# EAGLE design I2C_Breakout_Block (EAGLE 6.6.0)

## Sheet 1 of 2
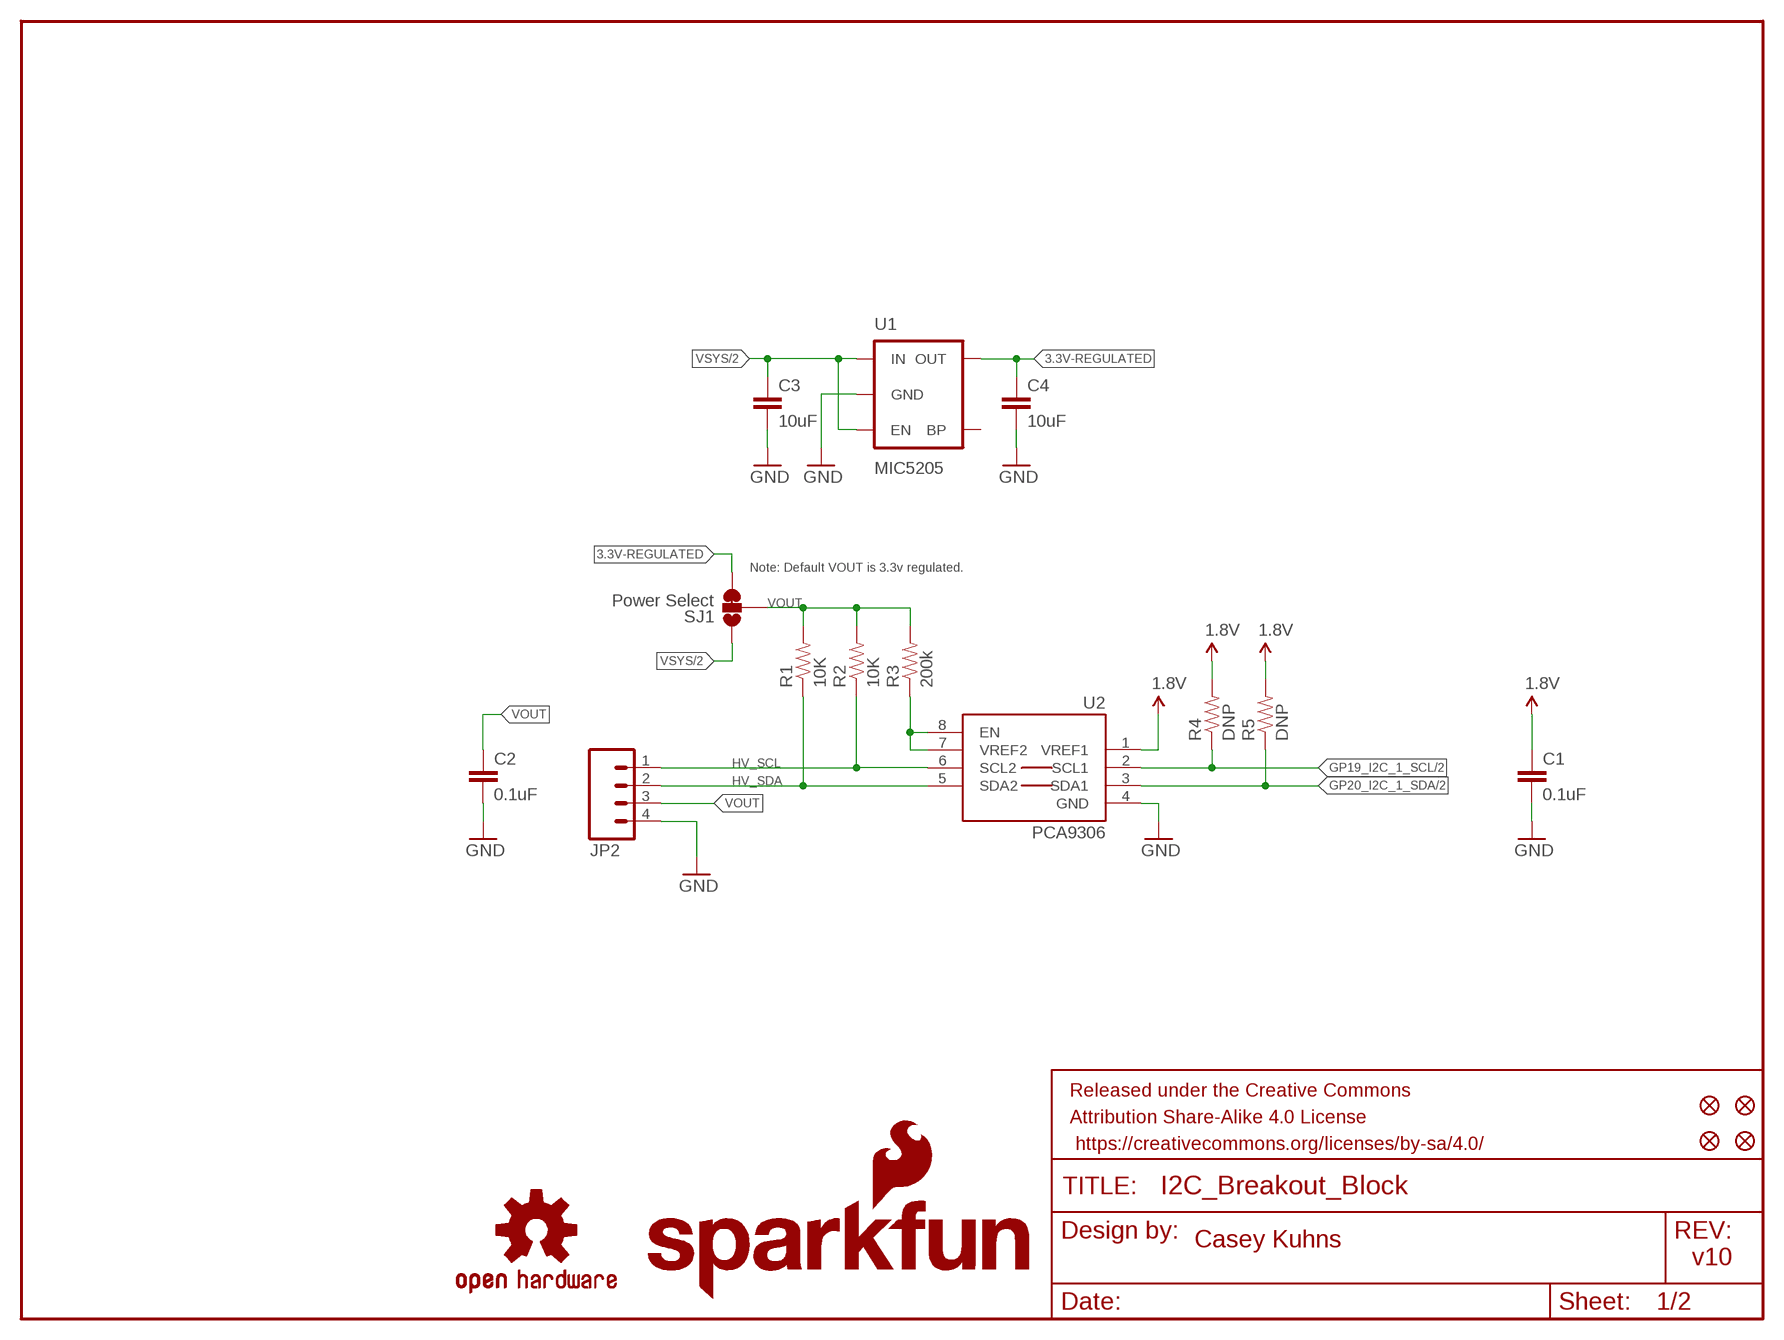
[diagram p0: schematic, sheet 1]

### Parts
C1  0.1uF  0.1UF-25V(+80/-20%)(0603)  [0603-CAP]
C2  0.1uF  0.1UF-25V(+80/-20%)(0603)  [0603-CAP]
C3  10uF  10UF-6.3V-20%(1206)  [1206]
C4  10uF  10UF-6.3V-20%(1206)  [1206]
FID1  FIDUCIAL1X2  [FIDUCIAL-1X2]
FID2  FIDUCIAL1X2  [FIDUCIAL-1X2]
FID3  FIDUCIAL1X2  [FIDUCIAL-1X2]
FID4  FIDUCIAL1X2  [FIDUCIAL-1X2]
FRAME1  FRAME-LETTER  [CREATIVE_COMMONS]
JP2  M04SMD_RA_FEMALE  [1X04_SMD_RA_FEMALE]
LOGO1  SFE_LOGO_NAME_FLAME.1_INCH  [SFE_LOGO_NAME_FLAME_.1]
LOGO2  OSHW-LOGOS  [OSHW-LOGO-S]
LOGO3  SFE_LOGO_NAME_FLAME.1_INCH  [SFE_LOGO_NAME_FLAME_.1]
LOGO4  OSHW-LOGOS  [OSHW-LOGO-S]
R1  10K  10KOHM1/10W1%(0603)0603  [0603-RES]
R2  10K  10KOHM1/10W1%(0603)0603  [0603-RES]
R3  200k  200KOHM1/10W1%(0603)200K  [0603-RES]
R4  DNP  2.2KOHM1/10W1%(0603)  [0603-RES]
R5  DNP  2.2KOHM1/10W1%(0603)  [0603-RES]
SJ1  Power Select  JUMPER-PAD-3-2OF3_NC_BY_TRACE  [PAD-JUMPER-3-2OF3_NC_BY_TRACE_YES_SILK_FULL_BOX]
U1  MIC5205  MIC52053.3V  [SOT23-5]
U2  PCA9306  PCA9306PCA9306DC-1:1  [PCA9306DC-1:1]

### Nets
1.8V: C1.1 R4.2 R5.2 U2.1(VREF1) ; also sheet 2
3.3V-REGULATED: C4.1 SJ1.3 U1.5(OUT)
GND: C1.2 C2.2 C3.2 C4.2 JP2.4 U1.2(GND) U2.4(GND) ; also sheet 2
GP19_I2C_1_SCL: R4.1 U2.2(SCL1) ; also sheet 2
GP20_I2C_1_SDA: R5.1 U2.3(SDA1) ; also sheet 2
HV_SCL: JP2.1 R2.1 U2.6(SCL2)
HV_SDA: JP2.2 R1.1 U2.5(SDA2)
N$1: R3.1 U2.7(VREF2) U2.8(EN)
VOUT: C2.1 JP2.3 R1.2 R2.2 R3.2 SJ1.2
VSYS: C3.1 SJ1.1 U1.1(IN) U1.3(EN) ; also sheet 2
Unconnected: U1.4(BP)

### Notes on the sheet
- Note: Default VOUT is 3.3v regulated.
- Casey Kuhns
- v10

## Sheet 2 of 2
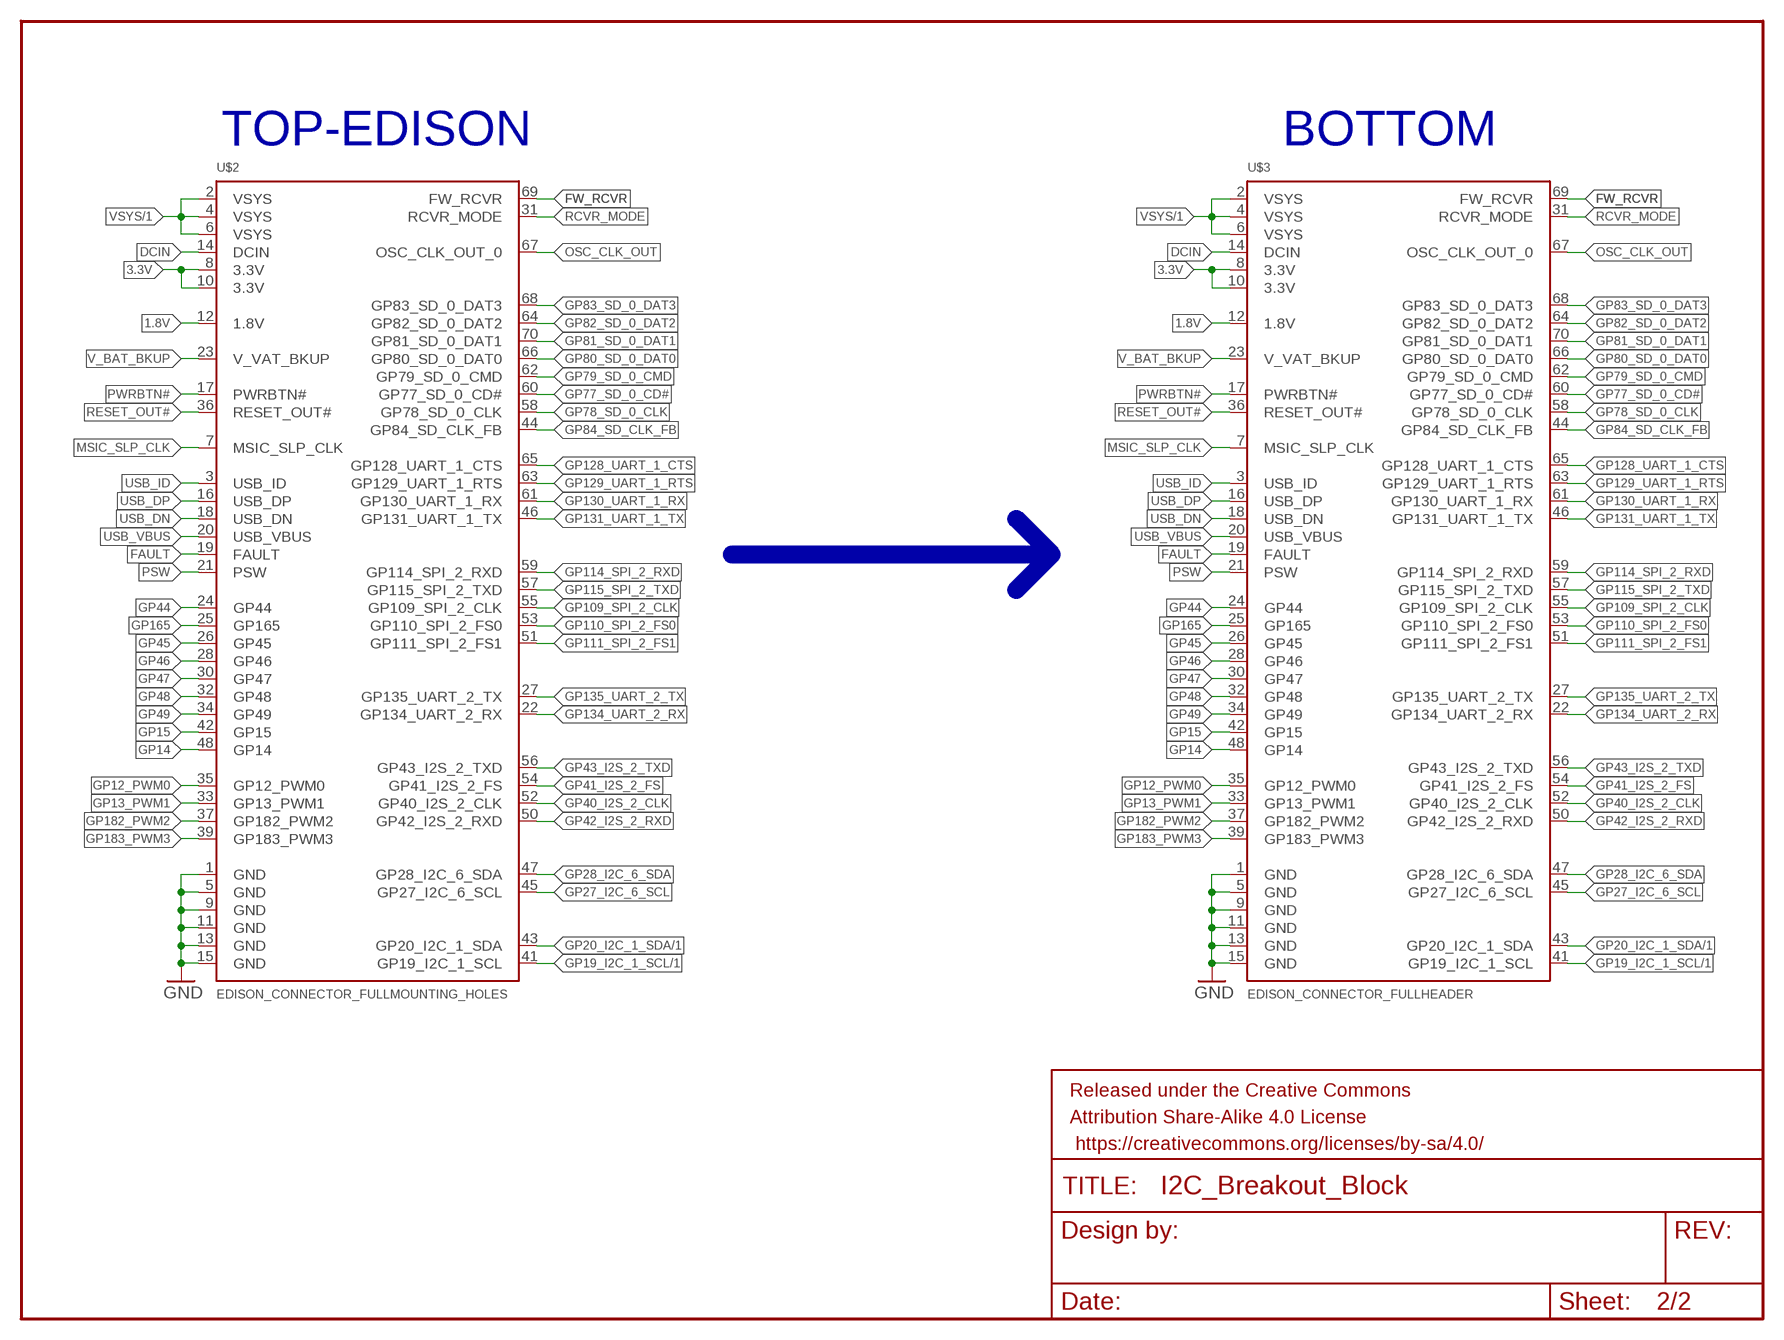
[diagram p1: schematic, sheet 2]

### Parts
FRAME2  FRAME-LETTER  [CREATIVE_COMMONS]
U$2  EDISON_CONNECTOR_FULLMOUNTING_HOLES  [EDISON_DAUGHTER]
U$3  EDISON_CONNECTOR_FULLHEADER  [DF40C-70DP-0.4(51)]

### Nets
1.8V: U$2.12(1.8V) U$3.12(1.8V) ; also sheet 1
3.3V: U$2.8(3.3V) U$2.10(3.3V) U$3.8(3.3V) U$3.10(3.3V)
DCIN: U$2.14(DCIN) U$3.14(DCIN)
FAULT: U$2.19(FAULT) U$3.19(FAULT)
FW_RCVR: U$2.69(FW_RCVR) U$3.69(FW_RCVR)
GND: U$2.1(GND) U$2.5(GND) U$2.9(GND) U$2.11(GND) U$2.13(GND) U$2.15(GND) U$3.1(GND) U$3.5(GND) U$3.9(GND) U$3.11(GND) U$3.13(GND) U$3.15(GND) ; also sheet 1
GP12_PWM0: U$2.35(GP12_PWM0) U$3.35(GP12_PWM0)
GP13_PWM1: U$2.33(GP13_PWM1) U$3.33(GP13_PWM1)
GP14: U$2.48(GP14) U$3.48(GP14)
GP15: U$2.42(GP15) U$3.42(GP15)
GP19_I2C_1_SCL: U$2.41(GP19_I2C_1_SCL) U$3.41(GP19_I2C_1_SCL) ; also sheet 1
GP20_I2C_1_SDA: U$2.43(GP20_I2C_1_SDA) U$3.43(GP20_I2C_1_SDA) ; also sheet 1
GP27_I2C_6_SCL: U$2.45(GP27_I2C_6_SCL) U$3.45(GP27_I2C_6_SCL)
GP28_I2C_6_SDA: U$2.47(GP28_I2C_6_SDA) U$3.47(GP28_I2C_6_SDA)
GP40_I2S_2_CLK: U$2.52(GP40_I2S_2_CLK) U$3.52(GP40_I2S_2_CLK)
GP41_I2S_2_FS: U$2.54(GP41_I2S_2_FS) U$3.54(GP41_I2S_2_FS)
GP42_I2S_2_RXD: U$2.50(GP42_I2S_2_RXD) U$3.50(GP42_I2S_2_RXD)
GP43_I2S_2_TXD: U$2.56(GP43_I2S_2_TXD) U$3.56(GP43_I2S_2_TXD)
GP44: U$2.24(GP44) U$3.24(GP44)
GP45: U$2.26(GP45) U$3.26(GP45)
GP46: U$2.28(GP46) U$3.28(GP46)
GP47: U$2.30(GP47) U$3.30(GP47)
GP48: U$2.32(GP48) U$3.32(GP48)
GP49: U$2.34(GP49) U$3.34(GP49)
GP77_SD_0_CD#: U$2.60(GP77_SD_0_CD#) U$3.60(GP77_SD_0_CD#)
GP78_SD_0_CLK: U$2.58(GP78_SD_0_CLK) U$3.58(GP78_SD_0_CLK)
GP79_SD_0_CMD: U$2.62(GP79_SD_0_CMD) U$3.62(GP79_SD_0_CMD)
GP80_SD_0_DAT0: U$2.66(GP80_SD_0_DAT0) U$3.66(GP80_SD_0_DAT0)
GP81_SD_0_DAT1: U$2.70(GP81_SD_0_DAT1) U$3.70(GP81_SD_0_DAT1)
GP82_SD_0_DAT2: U$2.64(GP82_SD_0_DAT2) U$3.64(GP82_SD_0_DAT2)
GP83_SD_0_DAT3: U$2.68(GP83_SD_0_DAT3) U$3.68(GP83_SD_0_DAT3)
GP84_SD_CLK_FB: U$2.44(GP84_SD_CLK_FB) U$3.44(GP84_SD_CLK_FB)
GP109_SPI_2_CLK: U$2.55(GP109_SPI_2_CLK) U$3.55(GP109_SPI_2_CLK)
GP110_SPI_2_FS0: U$2.53(GP110_SPI_2_FS0) U$3.53(GP110_SPI_2_FS0)
GP111_SPI_2_FS1: U$2.51(GP111_SPI_2_FS1) U$3.51(GP111_SPI_2_FS1)
GP114_SPI_2_RXD: U$2.59(GP114_SPI_2_RXD) U$3.59(GP114_SPI_2_RXD)
GP115_SPI_2_TXD: U$2.57(GP115_SPI_2_TXD) U$3.57(GP115_SPI_2_TXD)
GP128_UART_1_CTS: U$2.65(GP128_UART_1_CTS) U$3.65(GP128_UART_1_CTS)
GP129_UART_1_RTS: U$2.63(GP129_UART_1_RTS) U$3.63(GP129_UART_1_RTS)
GP130_UART_1_RX: U$2.61(GP130_UART_1_RX) U$3.61(GP130_UART_1_RX)
GP131_UART_1_TX: U$2.46(GP131_UART_1_TX) U$3.46(GP131_UART_1_TX)
GP134_UART_2_RX: U$2.22(GP134_UART_2_RX) U$3.22(GP134_UART_2_RX)
GP135_UART_2_TX: U$2.27(GP135_UART_2_TX) U$3.27(GP135_UART_2_TX)
GP165: U$2.25(GP165) U$3.25(GP165)
GP182_PWM2: U$2.37(GP182_PWM2) U$3.37(GP182_PWM2)
GP183_PWM3: U$2.39(GP183_PWM3) U$3.39(GP183_PWM3)
MSIC_SLP_CLK: U$2.7(MSIC_SLP_CLK) U$3.7(MSIC_SLP_CLK)
OSC_CLK_OUT: U$2.67(OSC_CLK_OUT_0) U$3.67(OSC_CLK_OUT_0)
PSW: U$2.21(PSW) U$3.21(PSW)
PWRBTN#: U$2.17(PWRBTN#) U$3.17(PWRBTN#)
RCVR_MODE: U$2.31(RCVR_MODE) U$3.31(RCVR_MODE)
RESET_OUT#: U$2.36(RESET_OUT#) U$3.36(RESET_OUT#)
USB_DN: U$2.18(USB_DN) U$3.18(USB_DN)
USB_DP: U$2.16(USB_DP) U$3.16(USB_DP)
USB_ID: U$2.3(USB_ID) U$3.3(USB_ID)
USB_VBUS: U$2.20(USB_VBUS) U$3.20(USB_VBUS)
V_BAT_BKUP: U$2.23(V_VAT_BKUP) U$3.23(V_VAT_BKUP)
VSYS: U$2.2(VSYS) U$2.4(VSYS) U$2.6(VSYS) U$3.2(VSYS) U$3.4(VSYS) U$3.6(VSYS) ; also sheet 1

### Buses
B$1

### Notes on the sheet
- TOP-EDISON | BOTTOM

## Library data of the parts
C1 C2 = SparkFun-Capacitors:0.1UF-25V(+80/-20%)(0603): CAP-00810 Ceramic Standard decoupling cap; PROD_ID: CAP-00810
C3 C4 = SparkFun-Capacitors:10UF-6.3V-20%(1206): CAP-10057 Ceramic; PROD_ID: CAP-10057
FID1-FID4 = SparkFun-Aesthetics:FIDUCIAL: Fiducial Alignment Points Various fiducial points for machine vision alignment.
FRAME1 FRAME2 = SparkFun-Aesthetics:FRAME-LETTER: Schematic Frame Standard 8.5x11 US Letter frame
JP2 = SparkFun-Connectors:M04: Header 4 Standard 4-pin 0.1" header. Use with straight break away headers (SKU : PRT-00116), right angle break away headers (PRT-00553), swiss pins (PRT-00743), machine pins (PRT-00117), and female headers (PRT-00115). Molex polarized connector foot print use with SKU : PRT-08231 with associated crimp pins and housings. 1MM SMD Version SKU: PRT-10208
LOGO1 LOGO3 = SparkFun-Aesthetics:SFE_LOGO_NAME_FLAME: SFE Logo, name and flame This is the SparkFun full logo. The logo on the schematic will always be the same size; the package variant is the height of the flame part of the logo. Default layer for the logo on the board is tSilk.
LOGO2 LOGO4 = SparkFun-Aesthetics:OSHW-LOGO: Open Source Hardware Logo This logo indicates the piece of hardware it is found on incorporates a OSHW license and/or adheres to the definition of open source hardware found here: http://freedomdefined.org/OSHW
R1 R2 = SparkFun-Resistors:10KOHM1/10W1%(0603): RES-00824; PROD_ID: RES-00824
R3 = SparkFun-Resistors:200KOHM1/10W1%(0603): RES-09385; PROD_ID: RES-09385
R4 R5 = SparkFun-Resistors:2.2KOHM1/10W1%(0603): RES-08272; PROD_ID: RES-08272; VALUE: 2.2k
SJ1 = SparkFun-Passives:JUMPER-PAD-3-2OF3_NC_BY_TRACE
U1 = SparkFun-PowerIC:MIC5205: MIC5205 150mA vreg 3.3V - VREG-00822 5V - VREG-00823; PROD_ID: VREG-00822
U2 = SparkFun-DigitalIC:PCA9306: Bidirectional I2C level shifter. NOT compatible with all available part number pinout schemes- DOUBLE CHECK!!!; PROD_ID: IC-10023
U$2 U$3 = Edison:EDISON_CONNECTOR_FULL

## Board
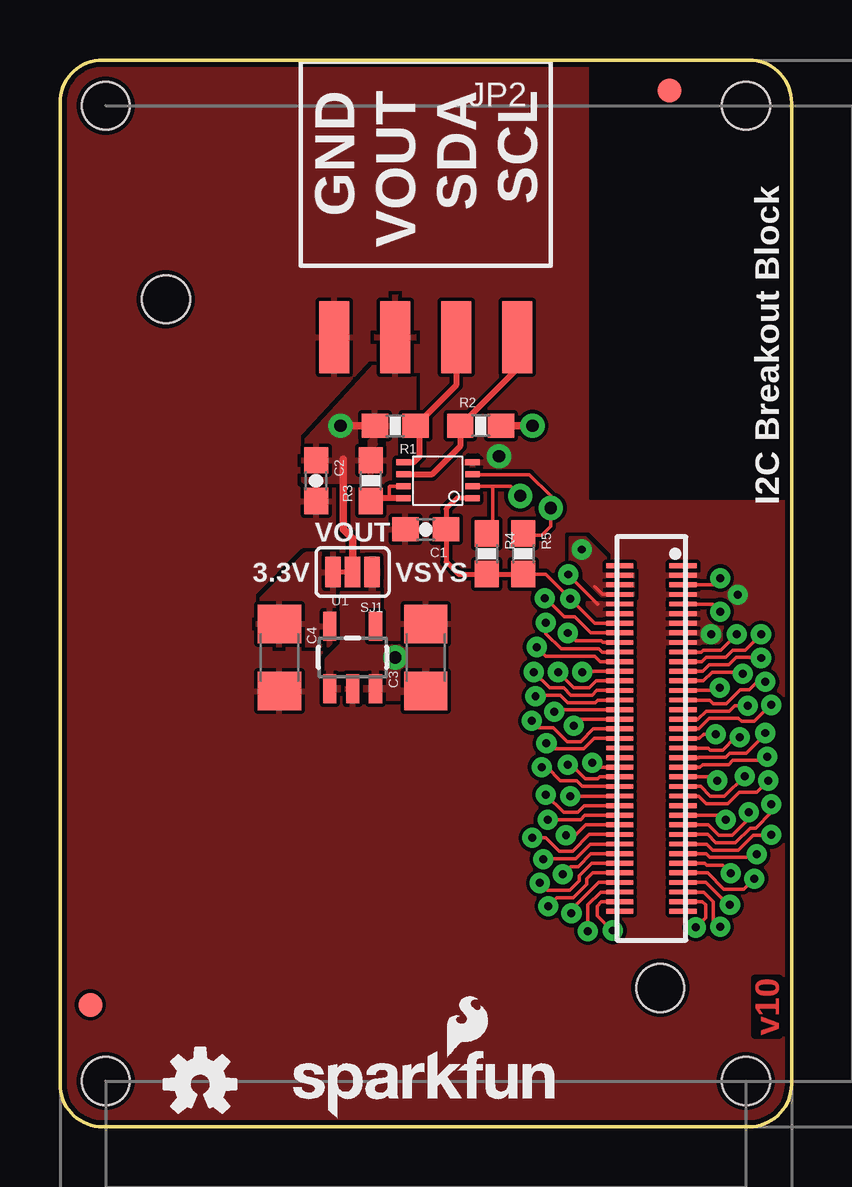
[diagram p2: board, top side]
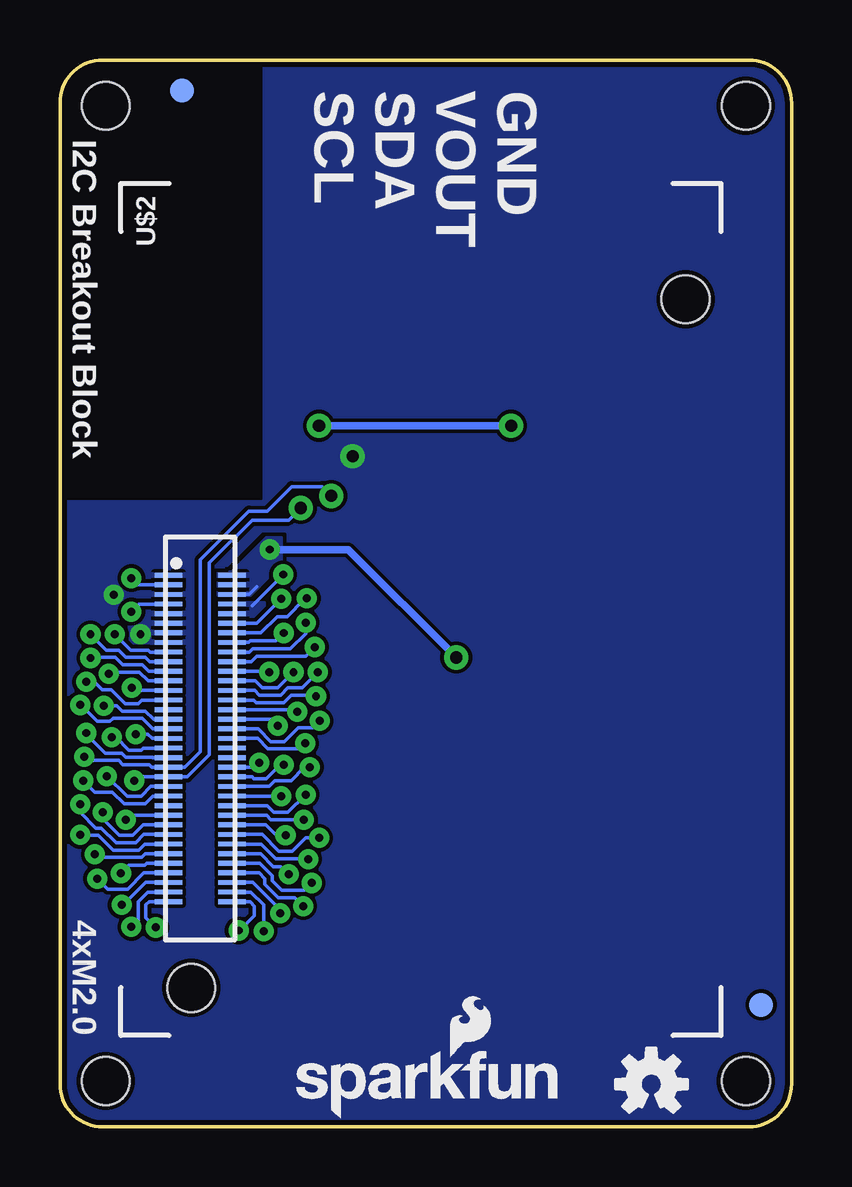
[diagram p3: board, bottom side, seen from below]

Size 30.48 x 44.45 mm. Coordinates in mm from the lower left corner, seen from the top.
Outline: 30.48,42.67 30.48,1.78 arc-90 28.7,0 1.78,0 arc-90 0,1.78 0,42.67 arc-90 1.78,44.45 28.7,44.45 arc-90 30.48,42.67
Copper layers (1*16): Top 0.035mm / dielectric 1.5mm / Bottom 0.035mm
Design rules "SparkFun-2-layer *": minimum track width 6mil, minimum drill 13mil, track to track 6mil, track to pad 6mil, pad to pad 6mil, via to via 6mil, smd to smd 6mil, copper to edge 8mil, drill to drill 8mil, minimum pad ring 12mil, minimum via ring 10mil, stop-mask expansion 4mil, vias tented up to drill 20mil, thermal gap 6mil
Holes 2 mm at 28.57,1.91 1.91,1.91 1.91,42.55 28.57,42.55
tRestrict: area 22.1,26.2 to 30.5,44.5; 1 lines
bRestrict: area 22.1,26.2 to 30.5,44.5

### Footprints (pad centres in the part's own frame; a part is rotated, then mirrored left to right if it is on the bottom)
0603-CAP = smd 1.1 x 1: 1 -0.85,0; 2 0.85,0
1206 = smd 1.6 x 1.8: 1 -1.4,0; 2 1.4,0
FIDUCIAL-1X2 = smd 1 x 1: 1 0,0
1X04_SMD_RA_FEMALE = smd 1.25 x 3: 1 -3.81,7.225; 2 -1.27,7.225; 3 1.27,7.225; 4 3.81,7.225
0603-RES = smd 1.1 x 1: 1 -0.85,0; 2 0.85,0
PAD-JUMPER-3-2OF3_NC_BY_TRACE_YES_SILK_FULL_BOX = smd 0.635 x 1.27: 1 -0.813,0; 2 0,0; 3 0.813,0
SOT23-5 = smd 0.55 x 1.2: 1 -0.95,-1.3; 2 0,-1.3; 3 0.95,-1.3; 4 0.95,1.3; 5 -0.95,1.3
PCA9306DC-1:1 = smd 0.25 x 0.602: 1 -0.73,-1.446; 2 -0.23,-1.446; 3 0.27,-1.446; 4 0.77,-1.446; 5 0.77,1.431; 6 0.27,1.431; 7 -0.23,1.431; 8 -0.73,1.431
EDISON_DAUGHTER = smd 1.14 x 0.2: 1 1.98,19.17; 2 4.62,19.17; 3 1.98,18.77; 4 4.62,18.77; 5 1.98,18.37; 6 4.62,18.37; 7 1.98,17.97; 8 4.62,17.97; 9 1.98,17.57; 10 4.62,17.57; 11 1.98,17.17; 12 4.62,17.17; 13 1.98,16.77; 14 4.62,16.77; 15 1.98,16.37; 16 4.62,16.37; 17 1.98,15.97; 18 4.62,15.97; 19 1.98,15.57; 20 4.62,15.57; 21 1.98,15.17; 22 4.62,15.17; 23 1.98,14.77; 24 4.62,14.77; 25 1.98,14.37; 26 4.62,14.37; 27 1.98,13.97; 28 4.62,13.97; 29 1.98,13.57; 30 4.62,13.57; 31 1.98,13.17; 32 4.62,13.17; 33 1.98,12.77; 34 4.62,12.77; 35 1.98,12.37; 36 4.62,12.37; 37 1.98,11.97; 38 4.62,11.97; 39 1.98,11.57; 40 4.62,11.57; 41 1.98,11.17; 42 4.62,11.17; 43 1.98,10.77; 44 4.62,10.77; 45 1.98,10.37; 46 4.62,10.37; 47 1.98,9.97; 48 4.62,9.97; 49 1.98,9.57; 50 4.62,9.57; 51 1.98,9.17; 52 4.62,9.17; 53 1.98,8.77; 54 4.62,8.77; 55 1.98,8.37; 56 4.62,8.37; 57 1.98,7.97; 58 4.62,7.97; 59 1.98,7.57; 60 4.62,7.57; 61 1.98,7.17; 62 4.62,7.17; 63 1.98,6.77; 64 4.62,6.77; 65 1.98,6.37; 66 4.62,6.37; 67 1.98,5.97; 68 4.62,5.97; 69 1.98,5.57; 70 4.62,5.57 | hole 2: 23.53,30.67; 2.93,1.98
DF40C-70DP-0.4(51) = smd 0.2 x 1.14 bottom: 1 6.8,1.32; 2 6.8,-1.32; 3 6.4,1.32; 4 6.4,-1.32; 5 6,1.32; 6 6,-1.32; 7 5.6,1.32; 8 5.6,-1.32; 9 5.2,1.32; 10 5.2,-1.32; 11 4.8,1.32; 12 4.8,-1.32; 13 4.4,1.32; 14 4.4,-1.32; 15 4,1.32; 16 4,-1.32; 17 3.6,1.32; 18 3.6,-1.32; 19 3.2,1.32; 20 3.2,-1.32; 21 2.8,1.32; 22 2.8,-1.32; 23 2.4,1.32; 24 2.4,-1.32; 25 2,1.32; 26 2,-1.32; 27 1.6,1.32; 28 1.6,-1.32; 29 1.2,1.32; 30 1.2,-1.32; 31 0.8,1.32; 32 0.8,-1.32; 33 0.4,1.32; 34 0.4,-1.32; 35 0,1.32; 36 0,-1.32; 37 -0.4,1.32; 38 -0.4,-1.32; 39 -0.8,1.32; 40 -0.8,-1.32; 41 -1.2,1.32; 42 -1.2,-1.32; 43 -1.6,1.32; 44 -1.6,-1.32; 45 -2,1.32; 46 -2,-1.32; 47 -2.4,1.32; 48 -2.4,-1.32; 49 -2.8,1.32; 50 -2.8,-1.32; 51 -3.2,1.32; 52 -3.2,-1.32; 53 -3.6,1.32; 54 -3.6,-1.32; 55 -4,1.32; 56 -4,-1.32; 57 -4.4,1.32; 58 -4.4,-1.32; 59 -4.8,1.32; 60 -4.8,-1.32; 61 -5.2,1.32; 62 -5.2,-1.32; 63 -5.6,1.32; 64 -5.6,-1.32; 65 -6,1.32; 66 -6,-1.32; 67 -6.4,1.32; 68 -6.4,-1.32; 69 -6.8,1.32; 70 -6.8,-1.32; NC1 7.2,1.32; NC2 7.2,-1.32; NC3 -7.2,-1.32; NC4 -7.2,1.32

### Placement (x,y rotation side)
C1  15.24,24.89 180 top
C2  10.67,26.92 270 top
C3  15.24,19.56 90 top
C4  9.14,19.56 270 top
FID1  25.4,43.18 0 bottom
FID2  25.4,43.18 0 top
FID3  1.27,5.08 0 bottom
FID4  1.27,5.08 0 top
FRAME1  -1.27,-13.97 0 top  (outside the outline)
FRAME2  -1.27,-13.97 0 top  (outside the outline)
JP2  15.24,40.13 180 top
LOGO1  9.27,0.25 0 top
LOGO2  5.84,1.78 0 bottom
LOGO3  21.08,0.25 0 bottom
LOGO4  5.84,1.78 0 top
R1  13.97,29.21 180 top
R2  17.53,29.21 0 top
R3  12.95,26.92 90 top
R4  17.78,23.88 270 top
R5  19.3,23.88 270 top
SJ1  12.19,23.11 180 top
U1  12.19,19.56 0 top
U2  15.75,26.92 90 top
U$2  27.94,3.81 0 bottom
U$3  24.64,16.18 90 bottom

### Tracks (layer width: path | path; a pad name or v marks a point on that pad's centre or on a via)
1.8V  (via drill 0.33)
  Top 0.152: U$3.12 22.28,20.98 v21.26,22 20.23,23.03 R5.2
  Top 0.203: U2.1 16.54,26.19 16.09,25.74 C1.1 16.09,23.53 16.6,23.03 R4.2 R5.2
  Bottom 0.152: U$3.12 22.28,20.98 v21.26,22
3.3V  (via drill 0.33)
  Top 0.152: v21.18,23.01 22.42,21.78
  Bottom 0.152: 22.48,21.72 v21.18,23.01 | U$3.8
  pour Top (isolate 0.051): 21.97,21.84 23.75,21.84 23.75,21.21 21.97,21.21
  pour Bottom (isolate 0.051): 21.97,21.84 21.97,21.21 23.62,21.21 23.62,21.84
3.3V-REGULATED
  Top 0.203: 11.14,20.96 U1.5
  pour Top (rank 2): 8.51,20.07 8.26,20.07 8.26,21.84 10.29,23.88 11.68,23.88 11.68,20.19 11.56,20.07
DCIN  (via drill 0.33)
  Top 0.152: U$3.14 22.12,20.58 21.44,21.26 21.01,21.26 20.24,22.02 v20.19,22.02
  Bottom 0.152: U$3.14 22.12,20.58 21.44,21.26 21.01,21.26 20.3,21.97 20.24,22.02 v20.19,22.02
FAULT  (via drill 0.33)
  Top 0.152: U$3.19 26.75,19.38 26.92,19.56 27.74,19.56 28.04,19.86 28.55,19.86 v29.21,20.52
  Bottom 0.152: v29.21,20.52 28.55,19.86 28.04,19.86 27.74,19.56 26.92,19.56 26.75,19.38 U$3.19
FW_RCVR  (via drill 0.33)
  Top 0.152: v26.49,8.31 26.9,8.71 26.9,9.25 26.76,9.38 U$3.69
  Bottom 0.152: U$3.69 26.76,9.38 26.9,9.25 26.9,8.71 v26.49,8.31
GND  (via drill 0.33, 0.51)
  other vias: 27.13,20.52 28.24,22.17 18.29,27.94
  pour Bottom (isolate 0.051, rank 6): 30.48,42.67 30.48,1.78 arc-90 28.7,0 1.78,0 arc-90 0,1.78 0,42.67 arc-90 1.78,44.45 28.7,44.45 arc-90
  pour Top (isolate 0.051, rank 6): 30.48,1.73 arc-90 28.75,0 1.78,0 arc-90 0,1.78 0,42.67 arc-90 1.78,44.45 28.7,44.45 arc-90 30.48,42.67
GP12_PWM0  (via drill 0.33)
  Top 0.152: U$3.35 26.64,16.18 26.82,16.36 v27.33,16.36
  Bottom 0.152: v27.33,16.36 26.82,16.36 26.64,16.18 U$3.35 | U$3.35
GP13_PWM1  (via drill 0.33)
  Top 0.152: v29.64,17.58 29.62,17.58 28.93,16.89 28.4,16.89 28.27,17.02 27.05,17.02 26.61,16.58 U$3.33
  Bottom 0.152: U$3.33 26.61,16.58 27.05,17.02 28.27,17.02 28.4,16.89 28.93,16.89 29.62,17.58 v29.64,17.58
GP14  (via drill 0.33)
  Top 0.152: v21.26,13.77 21.27,13.78 U$3.48
  Bottom 0.152: U$3.48 21.27,13.78 v21.26,13.77
GP15  (via drill 0.33)
  Top 0.152: U$3.42 22.36,14.98 v22.17,15.16
  Bottom 0.152: v22.17,15.16 22.36,14.98 U$3.42
GP19_I2C_1_SCL  (via drill 0.33, 0.51)
  Top 0.152: U$3.41 26.66,14.98 26.77,15.09 27.86,15.09 28.04,15.27 29.31,15.27 v29.46,15.42 | v19.18,26.29 18.77,26.69 18.03,26.69 | 18.03,26.69 U2.2 | 18.03,24.98 18.03,26.69
  Top 0.203: R4.1 18.03,24.98
  Bottom 0.152: v29.46,15.42 29.31,15.27 28.04,15.27 27.86,15.09 26.77,15.09 26.66,14.98 U$3.41 25.28,14.98 24.64,15.62 24.64,23.62 22.61,25.65 21.84,25.65 20.83,26.67 19.56,26.67 v19.18,26.29
GP20_I2C_1_SDA  (via drill 0.33, 0.51)
  Top 0.152: U$3.43 27.23,14.58 v27.38,14.43 | U2.3 17.21,27.18 19.56,27.18 20.45,26.29 v20.45,25.78 20.45,25.02 20.07,24.64 19.39,24.64
  Top 0.203: R5.1 19.39,24.64
  Bottom 0.152: v27.38,14.43 27.23,14.58 U$3.43 | U$3.43 | U$3.43 25.17,14.58 24.26,15.49 24.26,23.5 22.48,25.27 20.95,25.27 v20.45,25.78
GP27_I2C_6_SCL  (via drill 0.33)
  Top 0.152: v28.52,14.61 27.69,13.77 27.1,13.77 26.69,14.18 U$3.45
  Bottom 0.152: U$3.45 26.69,14.18 27.1,13.77 27.69,13.77 v28.52,14.61
GP28_I2C_6_SDA  (via drill 0.33)
  Top 0.152: U$3.47 26.61,13.78 26.92,13.46 27.81,13.46 28.3,13.95 29.03,13.95 v29.52,14.43
  Bottom 0.152: v29.52,14.43 29.03,13.95 28.3,13.95 27.81,13.46 26.92,13.46 26.61,13.78 U$3.47
GP40_I2S_2_CLK  (via drill 0.33)
  Top 0.152: U$3.52 21.87,12.98 21.69,12.8 v20.32,12.8
  Bottom 0.152: v20.32,12.8 21.69,12.8 21.87,12.98 U$3.52
GP41_I2S_2_FS  (via drill 0.33)
  Top 0.152: v21.08,12.14 21.46,12.14 21.9,12.58 U$3.54
  Bottom 0.152: U$3.54 21.9,12.58 21.46,12.14 v21.08,12.14
GP42_I2S_2_RXD  (via drill 0.33)
  Top 0.152: U$3.50 21.84,13.38 21.57,13.11 20.98,13.11 v20.24,13.84
  Bottom 0.152: v20.24,13.84 20.98,13.11 21.57,13.11 21.84,13.38 U$3.50
GP43_I2S_2_TXD  (via drill 0.33)
  Top 0.152: U$3.56 22.06,12.18 21.36,11.48 20.8,11.48 20.24,12.04 v19.68,12.04
  Bottom 0.152: v19.68,12.04 20.24,12.04 20.8,11.48 21.36,11.48 22.06,12.18 U$3.56
GP44  (via drill 0.33)
  Top 0.152: U$3.24 22.34,18.58 22.05,18.29 21.41,18.29 v20.75,18.95
  Bottom 0.152: v20.75,18.95 21.41,18.29 22.05,18.29 22.34,18.58 U$3.24
GP45  (via drill 0.33)
  Top 0.152: v19.74,18.95 20.4,18.29 20.98,18.29 21.29,17.98 22.17,17.98 22.37,18.18 U$3.26
  Bottom 0.152: U$3.26 22.37,18.18 22.17,17.98 21.29,17.98 20.98,18.29 20.4,18.29 v19.74,18.95
GP46  (via drill 0.33)
  Top 0.152: U$3.28 22.4,17.78 22.3,17.68 21.16,17.68 20.85,17.98 19.86,17.98 v19.81,17.93
  Bottom 0.152: v19.81,17.93 19.86,17.98 20.85,17.98 21.16,17.68 22.3,17.68 22.4,17.78 U$3.28
GP47  (via drill 0.33)
  Top 0.152: U$3.30 22.43,17.38 22.43,17.37 20.68,17.37 v20.6,17.3
  Bottom 0.152: v20.6,17.3 20.68,17.37 22.43,17.37 22.43,17.38 U$3.30
GP48  (via drill 0.33)
  Top 0.152: v21.41,16.71 21.68,16.98 U$3.32
  Bottom 0.152: U$3.32 21.68,16.98 v21.41,16.71
GP49  (via drill 0.33)
  Top 0.152: U$3.34 22.22,16.58 21.69,16.05 21.13,16.05 20.55,16.64 19.94,16.64 v19.66,16.92
  Bottom 0.152: v19.66,16.92 19.94,16.64 20.55,16.64 21.13,16.05 21.69,16.05 22.22,16.58 U$3.34
GP77_SD_0_CD#  (via drill 0.33)
  Top 0.152: U$3.60 22.12,11.38 21.59,10.85 21.29,10.85 v20.95,10.52
  Bottom 0.152: v20.95,10.52 21.29,10.85 21.59,10.85 22.12,11.38 U$3.60
GP78_SD_0_CLK  (via drill 0.33)
  Top 0.152: U$3.58 22.09,11.78 21.49,11.18 20.17,11.18 v20.14,11.15
  Bottom 0.152: v20.14,11.15 20.17,11.18 21.49,11.18 22.09,11.78 U$3.58
GP79_SD_0_CMD  (via drill 0.33)
  Top 0.152: U$3.62 22.16,10.98 21.64,10.46 21.64,10.26 21.23,9.86 20.3,9.86 v19.99,10.16
  Bottom 0.152: v19.99,10.16 20.3,9.86 21.23,9.86 21.64,10.26 21.64,10.46 22.16,10.98 U$3.62
GP80_SD_0_DAT0  (via drill 0.33)
  Top 0.152: v21.31,8.89 21.31,9.04 22.45,10.18 U$3.66
  Bottom 0.152: U$3.66 22.45,10.18 21.31,9.04 v21.31,8.89
GP81_SD_0_DAT1  (via drill 0.33)
  Top 0.152: U$3.70 22.56,9.38 22.38,9.2 22.38,8.79 22.99,8.18 v23.04,8.18
  Bottom 0.152: v23.04,8.18 22.99,8.18 22.38,8.79 22.38,9.2 22.56,9.38 U$3.70
GP82_SD_0_DAT2  (via drill 0.33)
  Top 0.152: U$3.64 22.19,10.58 21.95,10.34 21.95,10.11 21.39,9.55 20.7,9.55 v20.34,9.2
  Bottom 0.152: v20.34,9.2 20.7,9.55 21.39,9.55 21.95,10.11 21.95,10.34 22.19,10.58 U$3.64
GP83_SD_0_DAT3  (via drill 0.33)
  Top 0.152: v22,8.15 22,9.25 22.53,9.78 U$3.68
  Bottom 0.152: U$3.68 22.53,9.78 22,9.25 v22,8.15
GP84_SD_CLK_FB  (via drill 0.33)
  Top 0.152: U$3.44 22.48,14.58 22.4,14.5 21.89,14.5 21.31,15.09 v21.16,15.09
  Bottom 0.152: v21.16,15.09 21.31,15.09 21.89,14.5 22.4,14.5 22.48,14.58 U$3.44 | U$3.44
GP109_SPI_2_CLK  (via drill 0.33)
  Top 0.152: U$3.55 26.99,12.18 27.33,11.84 28.14,11.84 28.75,12.45 28.98,12.45 29.64,13.11 v29.64,13.44
  Bottom 0.152: v29.64,13.44 29.64,13.11 28.98,12.45 28.75,12.45 28.14,11.84 27.33,11.84 26.99,12.18 U$3.55
GP110_SPI_2_FS0  (via drill 0.33)
  Top 0.152: v28.7,13.11 28.7,12.83 28.02,12.14 27.46,12.14 27.02,12.58 U$3.53
  Bottom 0.152: U$3.53 27.02,12.58 27.46,12.14 28.02,12.14 28.7,12.83 v28.7,13.11
GP111_SPI_2_FS1  (via drill 0.33)
  Top 0.152: v27.74,12.8 27.56,12.98 U$3.51
  Bottom 0.152: U$3.51 27.56,12.98 v27.74,12.8
GP114_SPI_2_RXD  (via drill 0.33)
  Top 0.152: U$3.59 26.92,11.38 27.08,11.23 28.91,11.23 v29.03,11.35
  Bottom 0.152: U$3.59 26.92,11.38 27.08,11.23 28.91,11.23 v29.03,11.35
GP115_SPI_2_TXD  (via drill 0.33)
  Top 0.152: U$3.57 26.95,11.78 27.2,11.53 28.27,11.53 28.88,12.14 29.62,12.14 v29.64,12.17
  Bottom 0.152: U$3.57 26.95,11.78 27.2,11.53 28.27,11.53 28.88,12.14 29.62,12.14 v29.64,12.17
GP128_UART_1_CTS  (via drill 0.33)
  Top 0.152: U$3.65 26.9,10.18 27.84,9.25 v27.91,9.25
  Bottom 0.152: v27.91,9.25 27.84,9.25 26.9,10.18 U$3.65
GP129_UART_1_RTS  (via drill 0.33)
  Top 0.152: v28.93,10.34 28.5,9.91 27.66,9.91 26.99,10.58 U$3.63
  Bottom 0.152: U$3.63 26.99,10.58 27.66,9.91 28.5,9.91 v28.93,10.34
GP130_UART_1_RX  (via drill 0.33)
  Top 0.152: v27.94,10.57 27.61,10.9 26.95,10.9 26.87,10.98 U$3.61
  Bottom 0.152: U$3.61 26.87,10.98 26.95,10.9 27.61,10.9 v27.94,10.57
GP131_UART_1_TX  (via drill 0.33)
  Top 0.152: U$3.46 22.52,14.18 22.5,14.2 21.77,14.2 21.54,14.43 20.85,14.43 20.3,14.99 v20.07,14.99
  Bottom 0.152: v20.07,14.99 20.3,14.99 20.85,14.43 21.54,14.43 21.77,14.2 22.5,14.2 22.52,14.18 U$3.46
GP134_UART_2_RX  (via drill 0.33)
  Top 0.152: v21.77,18.95 21.8,18.98 U$3.22
  Bottom 0.152: U$3.22 21.8,18.98 v21.77,18.95
GP135_UART_2_TX  (via drill 0.33)
  Top 0.152: v29.39,18.54 29.06,18.54 28.73,18.21 28.35,18.21 27.76,17.63 27.23,17.63 27.08,17.78 U$3.27
  Bottom 0.152: U$3.27 27.08,17.78 27.23,17.63 27.76,17.63 28.35,18.21 28.73,18.21 29.06,18.54 v29.39,18.54
GP165  (via drill 0.33)
  Top 0.152: v27.48,18.29 27.38,18.18 U$3.25
  Bottom 0.152: U$3.25 27.38,18.18 v27.48,18.29
GP182_PWM2  (via drill 0.33)
  Top 0.152: U$3.37 27.02,15.78 27.1,15.7 27.61,15.7 28.14,16.23 v28.32,16.23
  Bottom 0.152: v28.32,16.23 28.14,16.23 27.61,15.7 27.1,15.7 27.02,15.78 U$3.37
GP183_PWM3  (via drill 0.33)
  Top 0.152: v29.39,16.41 29.39,16.36 28.6,15.57 27.91,15.57 27.74,15.39 26.62,15.39 26.61,15.38 U$3.39
  Bottom 0.152: U$3.39 26.61,15.38 26.62,15.39 27.74,15.39 27.91,15.57 28.6,15.57 29.39,16.36 v29.39,16.41
HV_SCL
  Top 0.254: JP2.1 19.05,31.58 R2.1 16.68,28.36 15.51,27.19 U2.6
HV_SDA
  Top 0.254: JP2.2 16.51,30.9 R1.1 14.99,29.04 14.99,27.94 14.74,27.69 U2.5
MSIC_SLP_CLK  (via drill 0.33)
  Top 0.152: v27.51,21.46 27.19,21.78 U$3.7
  Bottom 0.152: U$3.7 27.19,21.78 v27.51,21.46
N$1
  Top 0.152: U2.7 13.74,26.69 13.72,26.67 13.72,26.19
  Top 0.254: U2.8 13.72,26.19 13.07,26.19 R3.1
OSC_CLK_OUT  (via drill 0.33)
  Top 0.152: v27.51,8.33 27.23,8.61 27.23,9.37 26.82,9.78 U$3.67
  Bottom 0.152: U$3.67 26.82,9.78 27.23,9.37 27.23,8.61 v27.51,8.33
PSW  (via drill 0.33)
  Top 0.152: v29.21,19.53 29.18,19.56 28.17,19.56 27.86,19.25 27.05,19.25 26.78,18.98 U$3.21
  Bottom 0.152: U$3.21 26.78,18.98 27.05,19.25 27.86,19.25 28.17,19.56 29.18,19.56 v29.21,19.53
PWRBTN#  (via drill 0.33)
  Top 0.152: v28.19,20.52 27.53,19.86 26.8,19.86 26.71,19.78 U$3.17
  Bottom 0.152: U$3.17 26.71,19.78 26.8,19.86 27.53,19.86 v28.19,20.52
RCVR_MODE  (via drill 0.33)
  Top 0.152: v28.65,17.55 28.12,17.55 27.89,17.32 26.92,17.32 26.58,16.98 U$3.31
  Bottom 0.152: U$3.31 26.58,16.98 26.92,17.32 27.89,17.32 28.12,17.55 v28.65,17.55
RESET_OUT#  (via drill 0.33)
  Top 0.152: U$3.36 22.25,16.18 21.82,15.75 20.5,15.75 v20.27,15.98
  Bottom 0.152: v20.27,15.98 20.5,15.75 21.82,15.75 22.25,16.18 U$3.36
USB_DN  (via drill 0.33)
  Top 0.152: U$3.18 22.59,19.78 22.45,19.91 20.88,19.91 20.24,20.55 v20.24,21.01
  Bottom 0.152: v20.24,21.01 20.24,20.55 20.88,19.91 22.45,19.91 22.59,19.78 U$3.18
USB_DP  (via drill 0.33)
  Top 0.152: U$3.16 22.62,20.18 22.55,20.24 21.49,20.24 v21.16,20.57
  Bottom 0.152: U$3.16 22.62,20.18 22.55,20.24 21.49,20.24 v21.16,20.57
USB_ID  (via drill 0.33)
  Top 0.152: v27.51,22.86 27.23,22.58 U$3.3
  Bottom 0.152: U$3.3 27.23,22.58 v27.51,22.86
USB_VBUS  (via drill 0.33)
  Top 0.152: v19.86,19.99 20.24,19.61 22.28,19.61 22.5,19.38 U$3.20
  Bottom 0.152: U$3.20 22.5,19.38 22.28,19.61 20.24,19.61 v19.86,19.99
V_BAT_BKUP  (via drill 0.33)
  Top 0.152: v28.45,18.87 28.37,18.95 27.18,18.95 26.81,18.58 U$3.23
  Bottom 0.152: U$3.23 26.81,18.58 27.18,18.95 28.37,18.95 v28.45,18.87
VOUT  (via drill 0.51)
  Top 0.203: R3.2 12.79,27.77 12.7,27.69
  Top 0.254: 13.12,27.94 R3.2
  Top 0.305: R2.2 v19.68,29.21 | v11.68,29.21 R1.2 | SJ1.2 12.19,24.51 11.81,24.89 11.81,27.81
  Bottom 0.305: v19.68,29.21 v11.68,29.21
  pour Top: 10.16,26.92 13.72,26.92 13.72,27.94 13.97,27.94 13.97,29.72 14.73,29.72 14.73,34.54 13.21,34.54 13.21,31.75 10.16,28.45
VSYS  (via drill 0.33, 0.51)
  Top 0.152: U$3.6 22.6,22.18 22.28,22.5
  Top 0.305: v13.97,19.56 14.1,19.56
  Bottom 0.152: U$3.6 22.6,22.18 22.28,22.5
  Bottom 0.305: v13.97,19.56 18.47,24.05 v21.74,24.05
  pour Top: 11.18,17.91 11.56,17.91 11.56,18.92 12.7,18.92 12.7,17.91 15.88,17.91 15.88,19.94 13.21,19.94 13.21,23.62 12.83,23.62 12.83,22.23 11.81,22.23 11.81,20.07 11.18,19.43
  pour Top (isolate 0.051, rank 2): 22.58,22.12 23.85,22.12 23.88,22.15 23.88,23.11 23.32,23.11 21.89,24.54 21.26,24.54 21.26,23.16 21.54,23.16
  pour Bottom (isolate 0.051, rank 2): 22.58,22.12 23.85,22.12 23.88,22.15 23.88,23.11 23.32,23.11 21.89,24.54 21.26,24.54 21.26,23.16 21.54,23.16

### Text on the board
Top: v10
tPlace: GND | VOUT | SDA | SCL | I2C Breakout Block | VOUT | 3.3V | VSYS
bPlace: GND | VOUT | SDA | SCL | I2C Breakout Block | 4xM2.0
tDocu: Note: Units are in Inches | Casey Kuhns